# Altium schematic sheet mcu.SchDoc
size A3
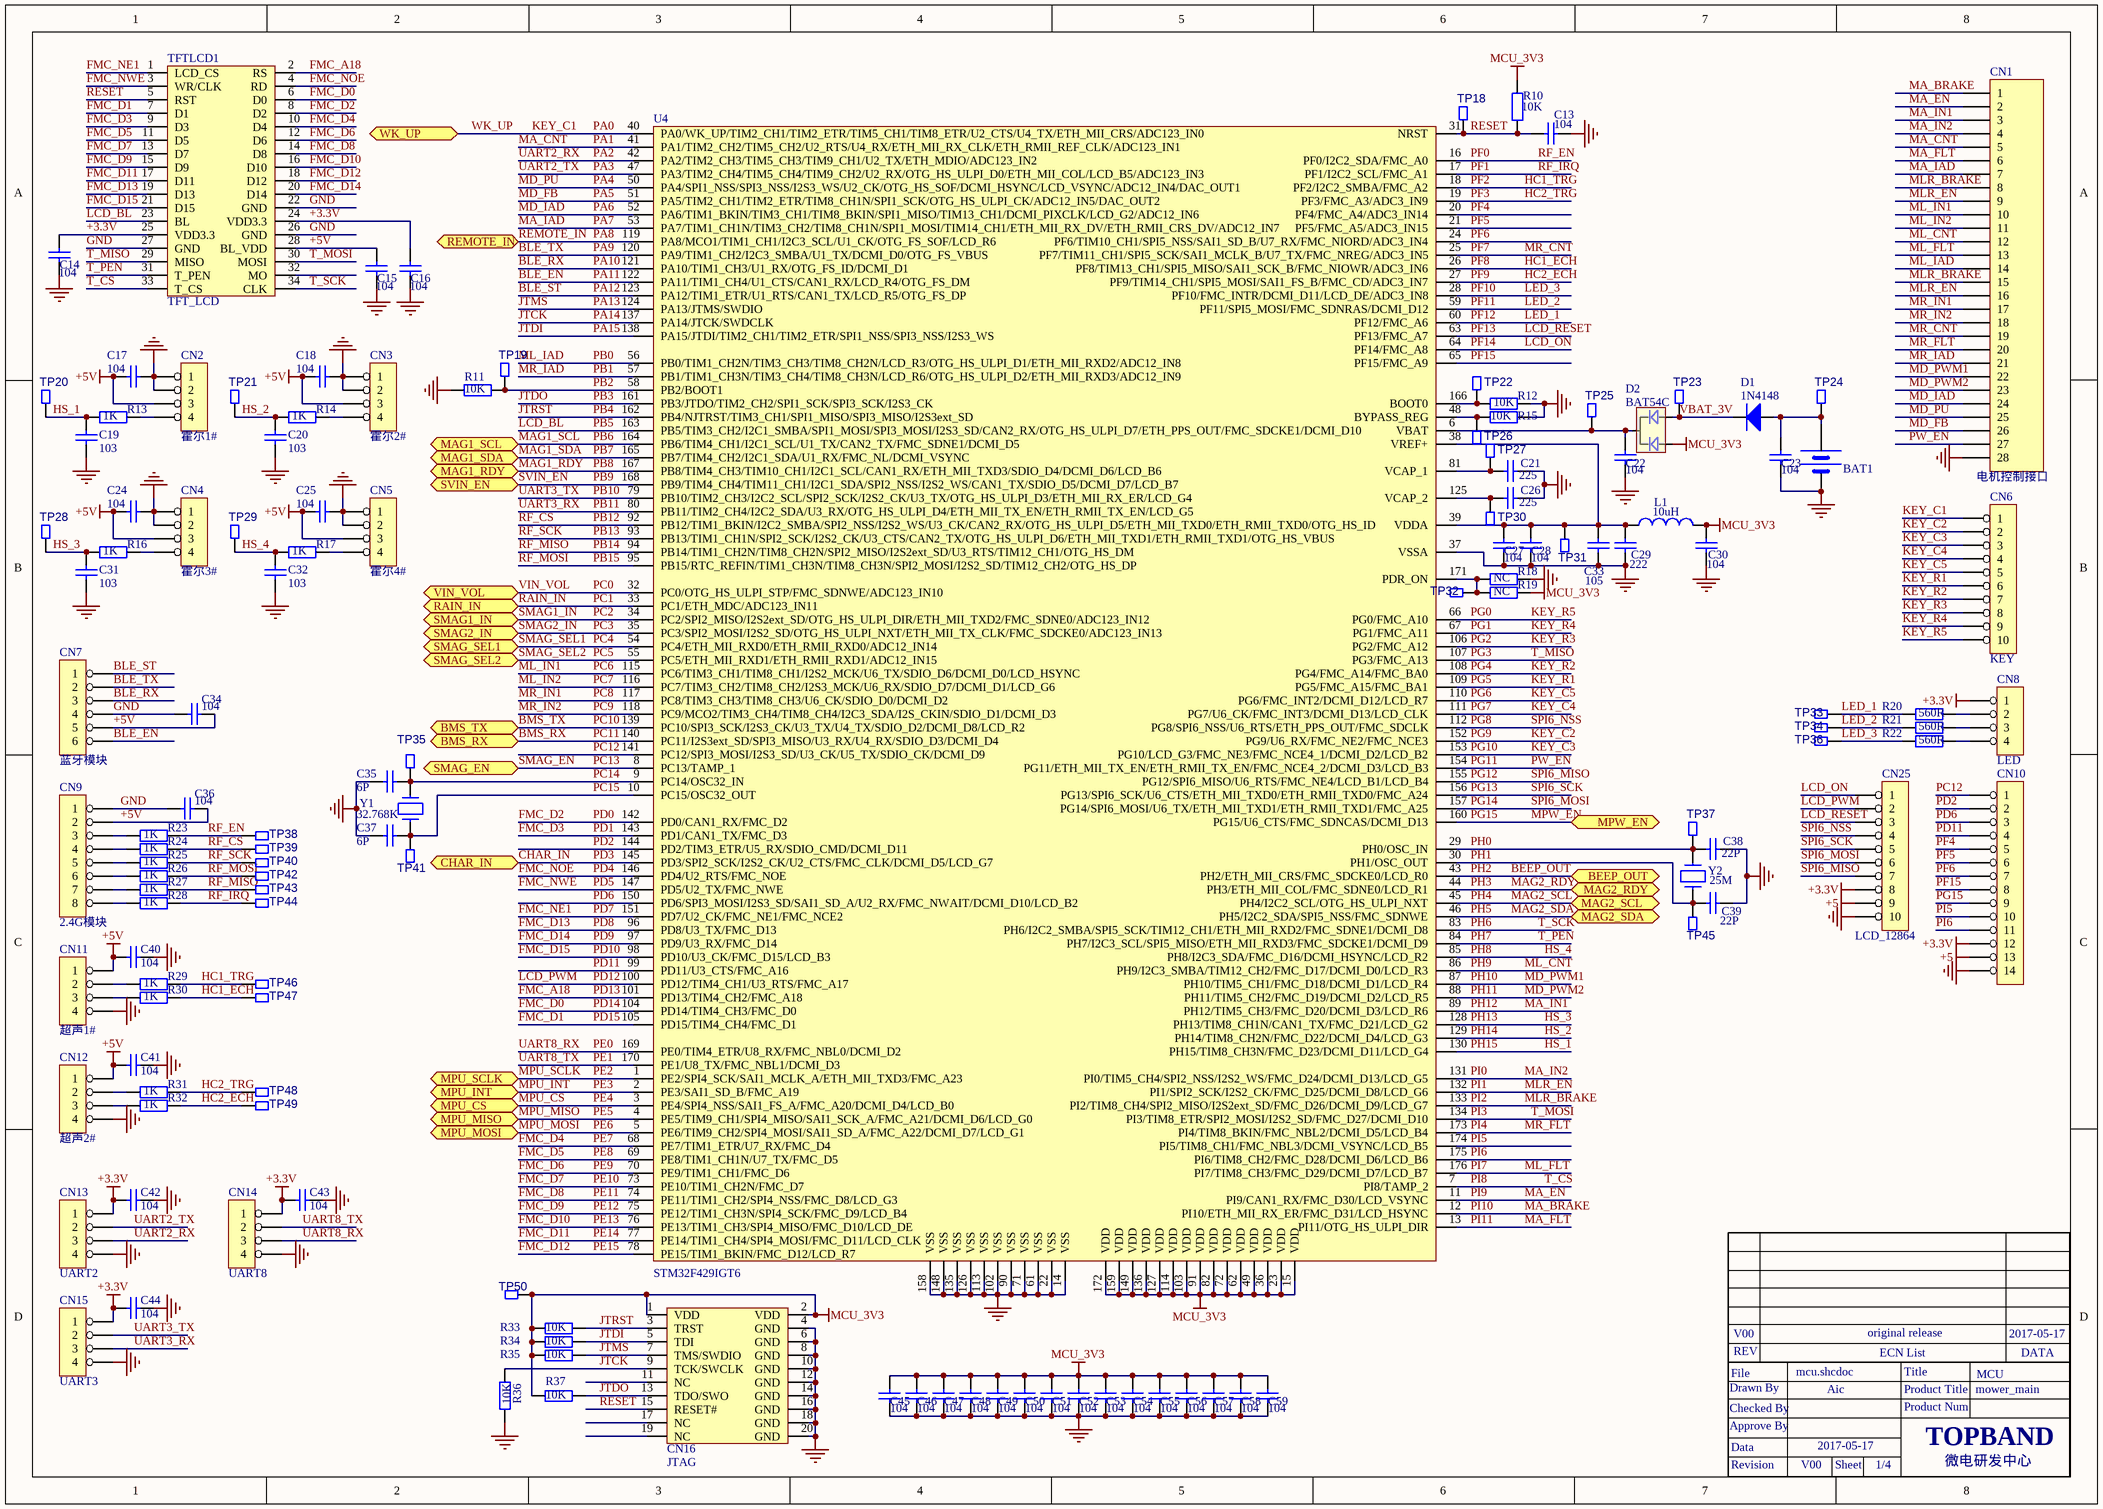
[diagram p0: mcu.SchDoc]

## Parts
BAT1  BATT  [BATM]  (value not drawn)
C13  104  [0603C]
C14  104  [0603C]
C15  104  [0603C]
C16  104  [0603C]
C17  104  [0603C]
C18  104  [0603C]
C19  103  [0603C]
C20  103  [0603C]
C21  225  [0603C]
C22  104  [0603C]
C23  104  [0603C]
C24  104  [0603C]
C25  104  [0603C]
C26  225  [0603C]
C27  104  [0603C]
C28  104  [0603C]
C29  222  [0603C]
C30  104  [0603C]
C31  103  [0603C]
C32  103  [0603C]
C33  105  [0603C]
C34  104  [0603C]
C35  6P  [0603C]
C36  104  [0603C]
C37  6P  [0603C]
C38  22P  [0603C]
C39  22P  [0603C]
C40  104  [0603C]
C41  104  [0603C]
C42  104  [0603C]
C43  104  [0603C]
C44  104  [0603C]
C45  104  [0603C]
C46  104  [0603C]
C47  104  [0603C]
C48  104  [0603C]
C49  104  [0603C]
C50  104  [0603C]
C51  104  [0603C]
C52  104  [0603C]
C53  104  [0603C]
C54  104  [0603C]
C55  104  [0603C]
C56  104  [0603C]
C57  104  [0603C]
C58  104  [0603C]
C59  104  [0603C]
CN1  电机控制接口  [CON2.54-2*14]
CN2  霍尔1#  [CON4-2.54]
CN3  霍尔2#  [CON4-2.54]
CN4  霍尔3#  [CON4-2.54]
CN5  霍尔4#  [CON4-2.54]
CN6  KEY  [CON2.54_10]
CN7  蓝牙模块  [CON6-2.54]
CN8  LED  [CON4-2.54]
CN9  2.4G模块  [CON2*4-2.54]
CN10  (no value)  [CON14-2.0卧式]
CN11  超声1#  [CON4-2.54]
CN12  超声2#  [CON4-2.54]
CN13  UART2  [CON4-2.54]
CN14  UART8  [CON4-2.54]
CN15  UART3  [CON4-2.54]
CN16  JTAG  [JTAG_20]
CN25  LCD_12864  [CON2.54_10]
D1  1N4148  [SOD-123]
D2  BAT54C  [SOT-23]
L1  10uH  [0805L-BOT]
R10  10K  [0603R]
R11  10K  [0603R]
R12  10K  [0603R]
R13  1K  [0603R]
R14  1K  [0603R]
R15  10K  [0603R]
R16  1K  [0603R]
R17  1K  [0603R]
R18  NC  [0603R]
R19  NC  [0603R]
R20  560R  [0603R]
R21  560R  [0603R]
R22  560R  [0603R]
R23  1K  [0603R]
R24  1K  [0603R]
R25  1K  [0603R]
R26  1K  [0603R]
R27  1K  [0603R]
R28  1K  [0603R]
R29  1K  [0603R]
R30  1K  [0603R]
R31  1K  [0603R]
R32  1K  [0603R]
R33  10K  [0603R]
R34  10K  [0603R]
R35  10K  [0603R]
R36  10K  [0603R]
R37  10K  [0603R]
TFTLCD1  TFT_LCD  [db2*17-4.3]
TP18  TP  [TEST-0.8MM]  (value not drawn)
TP19  TP  [TEST-0.8MM]  (value not drawn)
TP20  TP  [TEST-0.8MM]  (value not drawn)
TP21  TP  [TEST-0.8MM]  (value not drawn)
TP22  TP  [TEST-0.8MM]  (value not drawn)
TP23  TP  [TEST-0.8MM]  (value not drawn)
TP24  TP  [TEST-0.8MM]  (value not drawn)
TP25  TP  [TEST-0.8MM]  (value not drawn)
TP26  TP  [TEST-0.8MM]  (value not drawn)
TP27  TP  [TEST-0.8MM]  (value not drawn)
TP28  TP  [TEST-0.8MM]  (value not drawn)
TP29  TP  [TEST-0.8MM]  (value not drawn)
TP30  TP  [TEST-0.8MM]  (value not drawn)
TP31  TP  [TEST-0.8MM]  (value not drawn)
TP32  TP  [TEST-0.8MM]  (value not drawn)
TP33  TP  [TEST-0.8MM]  (value not drawn)
TP34  TP  [TEST-0.8MM]  (value not drawn)
TP35  TP  [TEST-0.8MM]  (value not drawn)
TP36  TP  [TEST-0.8MM]  (value not drawn)
TP37  TP  [TEST-0.8MM]  (value not drawn)
TP38  TP  [TEST-0.8MM]  (value not drawn)
TP39  TP  [TEST-0.8MM]  (value not drawn)
TP40  TP  [TEST-0.8MM]  (value not drawn)
TP41  TP  [TEST-0.8MM]  (value not drawn)
TP42  TP  [TEST-0.8MM]  (value not drawn)
TP43  TP  [TEST-0.8MM]  (value not drawn)
TP44  TP  [TEST-0.8MM]  (value not drawn)
TP45  TP  [TEST-0.8MM]  (value not drawn)
TP46  TP  [TEST-0.8MM]  (value not drawn)
TP47  TP  [TEST-0.8MM]  (value not drawn)
TP48  TP  [TEST-0.8MM]  (value not drawn)
TP49  TP  [TEST-0.8MM]  (value not drawn)
TP50  TP  [TEST-0.8MM]  (value not drawn)
U4  STM32F429IGT6  [LQFP176]
Y1  32.768K  [XTAL1]
Y2  25M  [XTAL-J]

## Ports
BEEP_OUT, BMS_RX, BMS_TX, CHAR_IN, MAG1_RDY, MAG1_SCL, MAG1_SDA, MAG2_RDY, MAG2_SCL, MAG2_SDA, MPU_CS, MPU_INT, MPU_MISO, MPU_MOSI, MPU_SCLK, MPW_EN, RAIN_IN, REMOTE_IN, SMAG1_IN, SMAG2_IN, SMAG_EN, SMAG_SEL1, SMAG_SEL2, SVIN_EN, VIN_VOL, WK_UP

## Nets
+3.3V: C14.2 C16.2 C42.1 C43.1 C44.1 CN8.1 CN10.12 CN13.1 CN14.1 CN15.1 CN25.8 TFTLCD1.24(VDD3.3) TFTLCD1.25(VDD3.3)
+5: CN10.13 CN25.9
+5V: C15.2 C17.1 C18.1 C24.1 C25.1 C34.1 C36.2 C40.1 C41.1 CN2.3 CN3.3 CN4.3 CN5.3 CN7.5 CN9.2 CN11.1 CN12.1 TFTLCD1.28(BL_VDD)
GND: BAT1.2(GND) C13.1 C14.1 C15.1 C16.1 C17.2 C18.2 C19.1 C20.1 C21.1 C22.2 C23.2 C24.2 C25.2 C26.1 C27.2 C28.2 C29.2 C30.2 C31.1 C32.1 C33.2 C34.2 C35.1 C36.1 C37.1 C38.1 C39.1 C40.2 C41.2 C42.2 C43.2 C44.2 C45.2 C46.2 C47.2 C48.2 C49.2 C50.2 C51.2 C52.2 C53.2 C54.2 C55.2 C56.2 C57.2 C58.2 C59.2 CN1.28 CN2.1 CN2.2 CN3.1 CN3.2 CN4.1 CN4.2 CN5.1 CN5.2 CN7.4 CN9.1 CN10.14 CN11.4 CN12.4 CN13.4 CN14.4 CN15.4 CN16.4(GND) CN16.6(GND) CN16.8(GND) CN16.10(GND) CN16.12(GND) CN16.14(GND) CN16.16(GND) CN16.18(GND) CN16.20(GND) CN25.10 R11.1 R12.1 R15.1 R18.1 R36.2 TFTLCD1.22(GND) TFTLCD1.26(GND) TFTLCD1.27(GND) U4.14(VSS) U4.22(VSS) U4.37(VSSA) U4.61(VSS) U4.71(VSS) U4.90(VSS) U4.102(VSS) U4.113(VSS) U4.126(VSS) U4.135(VSS) U4.148(VSS) U4.158(VSS)
MCU_3V3: C30.1 C45.1 C46.1 C47.1 C48.1 C49.1 C50.1 C51.1 C52.1 C53.1 C54.1 C55.1 C56.1 C57.1 C58.1 C59.1 CN16.1(VDD) CN16.2(VDD) D2.1 L1.2 R10.2 R19.1 R33.2 R34.2 R35.2 R37.2 TP50.1 U4.15(VDD) U4.23(VDD) U4.36(VDD) U4.49(VDD) U4.62(VDD) U4.72(VDD) U4.82(VDD) U4.91(VDD) U4.103(VDD) U4.114(VDD) U4.127(VDD) U4.136(VDD) U4.149(VDD) U4.159(VDD) U4.172(VDD)
BEEP_OUT: U4.43(PH2/ETH_MII_CRS/FMC_SDCKE0/LCD_R0) ; port BEEP_OUT  [also labelled PH2]
BLE_EN: CN7.6 U4.122(PA11/TIM1_CH4/U1_CTS/CAN1_RX/LCD_R4/OTG_FS_DM)  [also labelled PA11]
BLE_RX: CN7.3 U4.121(PA10/TIM1_CH3/U1_RX/OTG_FS_ID/DCMI_D1)  [also labelled PA10]
BLE_ST: CN7.1 U4.123(PA12/TIM1_ETR/U1_RTS/CAN1_TX/LCD_R5/OTG_FS_DP)  [also labelled PA12]
BLE_TX: CN7.2 U4.120(PA9/TIM1_CH2/I2C3_SMBA/U1_TX/DCMI_D0/OTG_FS_VBUS)  [also labelled PA9]
BMS_RX: U4.140(PC11/I2S3ext_SD/SPI3_MISO/U3_RX/U4_RX/SDIO_D3/DCMI_D4) ; port BMS_RX  [also labelled PC11]
BMS_TX: U4.139(PC10/SPI3_SCK/I2S3_CK/U3_TX/U4_TX/SDIO_D2/DCMI_D8/LCD_R2) ; port BMS_TX  [also labelled PC10]
CHAR_IN: U4.145(PD3/SPI2_SCK/I2S2_CK/U2_CTS/FMC_CLK/DCMI_D5/LCD_G7) ; port CHAR_IN  [also labelled PD3]
FMC_A18: TFTLCD1.2(RS) U4.101(PD13/TIM4_CH2/FMC_A18)  [also labelled PD13]
FMC_D0: TFTLCD1.6(D0) U4.104(PD14/TIM4_CH3/FMC_D0)  [also labelled PD14]
FMC_D1: TFTLCD1.7(D1) U4.105(PD15/TIM4_CH4/FMC_D1)  [also labelled PD15]
FMC_D2: TFTLCD1.8(D2) U4.142(PD0/CAN1_RX/FMC_D2)  [also labelled PD0]
FMC_D3: TFTLCD1.9(D3) U4.143(PD1/CAN1_TX/FMC_D3)  [also labelled PD1]
FMC_D4: TFTLCD1.10(D4) U4.68(PE7/TIM1_ETR/U7_RX/FMC_D4)  [also labelled PE7]
FMC_D5: TFTLCD1.11(D5) U4.69(PE8/TIM1_CH1N/U7_TX/FMC_D5)  [also labelled PE8]
FMC_D6: TFTLCD1.12(D6) U4.70(PE9/TIM1_CH1/FMC_D6)  [also labelled PE9]
FMC_D7: TFTLCD1.13(D7) U4.73(PE10/TIM1_CH2N/FMC_D7)  [also labelled PE10]
FMC_D8: TFTLCD1.14(D8) U4.74(PE11/TIM1_CH2/SPI4_NSS/FMC_D8/LCD_G3)  [also labelled PE11]
FMC_D9: TFTLCD1.15(D9) U4.75(PE12/TIM1_CH3N/SPI4_SCK/FMC_D9/LCD_B4)  [also labelled PE12]
FMC_D10: TFTLCD1.16(D10) U4.76(PE13/TIM1_CH3/SPI4_MISO/FMC_D10/LCD_DE)  [also labelled PE13]
FMC_D11: TFTLCD1.17(D11) U4.77(PE14/TIM1_CH4/SPI4_MOSI/FMC_D11/LCD_CLK)  [also labelled PE14]
FMC_D12: TFTLCD1.18(D12) U4.78(PE15/TIM1_BKIN/FMC_D12/LCD_R7)  [also labelled PE15]
FMC_D13: TFTLCD1.19(D13) U4.96(PD8/U3_TX/FMC_D13)  [also labelled PD8]
FMC_D14: TFTLCD1.20(D14) U4.97(PD9/U3_RX/FMC_D14)  [also labelled PD9]
FMC_D15: TFTLCD1.21(D15) U4.98(PD10/U3_CK/FMC_D15/LCD_B3)  [also labelled PD10]
FMC_NE1: TFTLCD1.1(LCD_CS) U4.151(PD7/U2_CK/FMC_NE1/FMC_NCE2)  [also labelled PD7]
FMC_NOE: TFTLCD1.4(RD) U4.146(PD4/U2_RTS/FMC_NOE)  [also labelled PD4]
FMC_NWE: TFTLCD1.3(WR/CLK) U4.147(PD5/U2_TX/FMC_NWE)  [also labelled PD5]
HC1_ECH: R30.1 TP47.1 U4.26(PF8/TIM13_CH1/SPI5_MISO/SAI1_SCK_B/FMC_NIOWR/ADC3_IN6)  [also labelled PF8]
HC1_TRG: R29.1 TP46.1 U4.18(PF2/I2C2_SMBA/FMC_A2)  [also labelled PF2]
HC2_ECH: R32.1 TP49.1 U4.27(PF9/TIM14_CH1/SPI5_MOSI/SAI1_FS_B/FMC_CD/ADC3_IN7)  [also labelled PF9]
HC2_TRG: R31.1 TP48.1 U4.19(PF3/FMC_A3/ADC3_IN9)  [also labelled PF3]
HS_1: C19.2 R13.2 TP20.1 U4.130(PH15/TIM8_CH3N/FMC_D23/DCMI_D11/LCD_G4)  [also labelled PH15]
HS_2: C20.2 R14.2 TP21.1 U4.129(PH14/TIM8_CH2N/FMC_D22/DCMI_D4/LCD_G3)  [also labelled PH14]
HS_3: C31.2 R16.2 TP28.1 U4.128(PH13/TIM8_CH1N/CAN1_TX/FMC_D21/LCD_G2)  [also labelled PH13]
HS_4: C32.2 R17.2 TP29.1 U4.85(PH8/I2C3_SDA/FMC_D16/DCMI_HSYNC/LCD_R2)  [also labelled PH8]
JTCK: CN16.9(TCK/SWCLK) R36.1 U4.137(PA14/JTCK/SWDCLK)  [also labelled PA14]
JTDI: CN16.5(TDI) R34.1 U4.138(PA15/JTDI/TIM2_CH1/TIM2_ETR/SPI1_NSS/SPI3_NSS/I2S3_WS)  [also labelled PA15]
JTDO: CN16.13(TDO/SWO) R37.1 U4.161(PB3/JTDO/TIM2_CH2/SPI1_SCK/SPI3_SCK/I2S3_CK)  [also labelled PB3]
JTMS: CN16.7(TMS/SWDIO) R35.1 U4.124(PA13/JTMS/SWDIO)  [also labelled PA13]
JTRST: CN16.3(TRST) R33.1 U4.162(PB4/NJTRST/TIM3_CH1/SPI1_MISO/SPI3_MISO/I2S3ext_SD)  [also labelled PB4]
KEY_C1: CN6.1 U4.40(PA0/WK_UP/TIM2_CH1/TIM2_ETR/TIM5_CH1/TIM8_ETR/U2_CTS/U4_TX/ETH_MII_CRS/ADC123_IN0) ; port WK_UP  [also labelled PA0, WK_UP]
KEY_C2: CN6.2 U4.152(PG9/U6_RX/FMC_NE2/FMC_NCE3)  [also labelled PG9]
KEY_C3: CN6.3 U4.153(PG10/LCD_G3/FMC_NE3/FMC_NCE4_1/DCMI_D2/LCD_B2)  [also labelled PG10]
KEY_C4: CN6.4 U4.111(PG7/U6_CK/FMC_INT3/DCMI_D13/LCD_CLK)  [also labelled PG7]
KEY_C5: CN6.5 U4.110(PG6/FMC_INT2/DCMI_D12/LCD_R7)  [also labelled PG6]
KEY_R1: CN6.6 U4.109(PG5/FMC_A15/FMC_BA1)  [also labelled PG5]
KEY_R2: CN6.7 U4.108(PG4/FMC_A14/FMC_BA0)  [also labelled PG4]
KEY_R3: CN6.8 U4.106(PG2/FMC_A12)  [also labelled PG2]
KEY_R4: CN6.9 U4.67(PG1/FMC_A11)  [also labelled PG1]
KEY_R5: CN6.10 U4.66(PG0/FMC_A10)  [also labelled PG0]
LCD_BL: TFTLCD1.23(BL) U4.163(PB5/TIM3_CH2/I2C1_SMBA/SPI1_MOSI/SPI3_MOSI/I2S3_SD/CAN2_RX/OTG_HS_ULPI_D7/ETH_PPS_OUT/FMC_SDCKE1/DCMI_D10)  [also labelled PB5]
LCD_ON: CN25.1 U4.64(PF14/FMC_A8)  [also labelled PF14]
LCD_PWM: CN25.2 U4.100(PD12/TIM4_CH1/U3_RTS/FMC_A17)  [also labelled PD12]
LCD_RESET: CN25.3 U4.63(PF13/FMC_A7)  [also labelled PF13]
LED_1: R20.2 TP33.1 U4.60(PF12/FMC_A6)  [also labelled PF12]
LED_2: R21.2 TP34.1 U4.59(PF11/SPI5_MOSI/FMC_SDNRAS/DCMI_D12)  [also labelled PF11]
LED_3: R22.2 TP36.1 U4.28(PF10/FMC_INTR/DCMI_D11/LCD_DE/ADC3_IN8)  [also labelled PF10]
MA_BRAKE: CN1.1 U4.12(PI10/ETH_MII_RX_ER/FMC_D31/LCD_HSYNC)  [also labelled PI10]
MA_CNT: CN1.5 U4.41(PA1/TIM2_CH2/TIM5_CH2/U2_RTS/U4_RX/ETH_MII_RX_CLK/ETH_RMII_REF_CLK/ADC123_IN1)  [also labelled PA1]
MA_EN: CN1.2 U4.11(PI9/CAN1_RX/FMC_D30/LCD_VSYNC)  [also labelled PI9]
MA_FLT: CN1.6 U4.13(PI11/OTG_HS_ULPI_DIR)  [also labelled PI11]
MA_IAD: CN1.7 U4.53(PA7/TIM1_CH1N/TIM3_CH2/TIM8_CH1N/SPI1_MOSI/TIM14_CH1/ETH_MII_RX_DV/ETH_RMII_CRS_DV/ADC12_IN7)  [also labelled PA7]
MA_IN1: CN1.3 U4.89(PH12/TIM5_CH3/FMC_D20/DCMI_D3/LCD_R6)  [also labelled PH12]
MA_IN2: CN1.4 U4.131(PI0/TIM5_CH4/SPI2_NSS/I2S2_WS/FMC_D24/DCMI_D13/LCD_G5)  [also labelled PI0]
MAG1_RDY: U4.167(PB8/TIM4_CH3/TIM10_CH1/I2C1_SCL/CAN1_RX/ETH_MII_TXD3/SDIO_D4/DCMI_D6/LCD_B6) ; port MAG1_RDY  [also labelled PB8]
MAG1_SCL: U4.164(PB6/TIM4_CH1/I2C1_SCL/U1_TX/CAN2_TX/FMC_SDNE1/DCMI_D5) ; port MAG1_SCL  [also labelled PB6]
MAG1_SDA: U4.165(PB7/TIM4_CH2/I2C1_SDA/U1_RX/FMC_NL/DCMI_VSYNC) ; port MAG1_SDA  [also labelled PB7]
MAG2_RDY: U4.44(PH3/ETH_MII_COL/FMC_SDNE0/LCD_R1) ; port MAG2_RDY  [also labelled PH3]
MAG2_SCL: U4.45(PH4/I2C2_SCL/OTG_HS_ULPI_NXT) ; port MAG2_SCL  [also labelled PH4]
MAG2_SDA: U4.46(PH5/I2C2_SDA/SPI5_NSS/FMC_SDNWE) ; port MAG2_SDA  [also labelled PH5]
MD_FB: CN1.26 U4.51(PA5/TIM2_CH1/TIM2_ETR/TIM8_CH1N/SPI1_SCK/OTG_HS_ULPI_CK/ADC12_IN5/DAC_OUT2)  [also labelled PA5]
MD_IAD: CN1.24 U4.52(PA6/TIM1_BKIN/TIM3_CH1/TIM8_BKIN/SPI1_MISO/TIM13_CH1/DCMI_PIXCLK/LCD_G2/ADC12_IN6)  [also labelled PA6]
MD_PU: CN1.25 U4.50(PA4/SPI1_NSS/SPI3_NSS/I2S3_WS/U2_CK/OTG_HS_SOF/DCMI_HSYNC/LCD_VSYNC/ADC12_IN4/DAC_OUT1)  [also labelled PA4]
MD_PWM1: CN1.22 U4.87(PH10/TIM5_CH1/FMC_D18/DCMI_D1/LCD_R4)  [also labelled PH10]
MD_PWM2: CN1.23 U4.88(PH11/TIM5_CH2/FMC_D19/DCMI_D2/LCD_R5)  [also labelled PH11]
ML_CNT: CN1.12 U4.86(PH9/I2C3_SMBA/TIM12_CH2/FMC_D17/DCMI_D0/LCD_R3)  [also labelled PH9]
ML_FLT: CN1.13 U4.176(PI7/TIM8_CH3/FMC_D29/DCMI_D7/LCD_B7)  [also labelled PI7]
ML_IAD: CN1.14 U4.56(PB0/TIM1_CH2N/TIM3_CH3/TIM8_CH2N/LCD_R3/OTG_HS_ULPI_D1/ETH_MII_RXD2/ADC12_IN8)  [also labelled PB0]
ML_IN1: CN1.10 U4.115(PC6/TIM3_CH1/TIM8_CH1/I2S2_MCK/U6_TX/SDIO_D6/DCMI_D0/LCD_HSYNC)  [also labelled PC6]
ML_IN2: CN1.11 U4.116(PC7/TIM3_CH2/TIM8_CH2/I2S3_MCK/U6_RX/SDIO_D7/DCMI_D1/LCD_G6)  [also labelled PC7]
MLR_BRAKE: CN1.8 CN1.15 U4.133(PI2/TIM8_CH4/SPI2_MISO/I2S2ext_SD/FMC_D26/DCMI_D9/LCD_G7)  [also labelled PI2]
MLR_EN: CN1.9 CN1.16 U4.132(PI1/SPI2_SCK/I2S2_CK/FMC_D25/DCMI_D8/LCD_G6)  [also labelled PI1]
MPU_CS: U4.3(PE4/SPI4_NSS/SAI1_FS_A/FMC_A20/DCMI_D4/LCD_B0) ; port MPU_CS  [also labelled PE4]
MPU_INT: U4.2(PE3/SAI1_SD_B/FMC_A19) ; port MPU_INT  [also labelled PE3]
MPU_MISO: U4.4(PE5/TIM9_CH1/SPI4_MISO/SAI1_SCK_A/FMC_A21/DCMI_D6/LCD_G0) ; port MPU_MISO  [also labelled PE5]
MPU_MOSI: U4.5(PE6/TIM9_CH2/SPI4_MOSI/SAI1_SD_A/FMC_A22/DCMI_D7/LCD_G1) ; port MPU_MOSI  [also labelled PE6]
MPU_SCLK: U4.1(PE2/SPI4_SCK/SAI1_MCLK_A/ETH_MII_TXD3/FMC_A23) ; port MPU_SCLK  [also labelled PE2]
MPW_EN: CN10.9 U4.160(PG15/U6_CTS/FMC_SDNCAS/DCMI_D13) ; port MPW_EN  [also labelled PG15]
MR_CNT: CN1.19 U4.25(PF7/TIM11_CH1/SPI5_SCK/SAI1_MCLK_B/U7_TX/FMC_NREG/ADC3_IN5)  [also labelled PF7]
MR_FLT: CN1.20 U4.173(PI4/TIM8_BKIN/FMC_NBL2/DCMI_D5/LCD_B4)  [also labelled PI4]
MR_IAD: CN1.21 U4.57(PB1/TIM1_CH3N/TIM3_CH4/TIM8_CH3N/LCD_R6/OTG_HS_ULPI_D2/ETH_MII_RXD3/ADC12_IN9)  [also labelled PB1]
MR_IN1: CN1.17 U4.117(PC8/TIM3_CH3/TIM8_CH3/U6_CK/SDIO_D0/DCMI_D2)  [also labelled PC8]
MR_IN2: CN1.18 U4.118(PC9/MCO2/TIM3_CH4/TIM8_CH4/I2C3_SDA/I2S_CKIN/SDIO_D1/DCMI_D3)  [also labelled PC9]
PA2: CN13.3 U4.42(PA2/TIM2_CH3/TIM5_CH3/TIM9_CH1/U2_TX/ETH_MDIO/ADC123_IN2)  [also labelled UART2_RX]
PA3: CN13.2 U4.47(PA3/TIM2_CH4/TIM5_CH4/TIM9_CH2/U2_RX/OTG_HS_ULPI_D0/ETH_MII_COL/LCD_B5/ADC123_IN3)  [also labelled UART2_TX]
PA8: U4.119(PA8/MCO1/TIM1_CH1/I2C3_SCL/U1_CK/OTG_FS_SOF/LCD_R6) ; port REMOTE_IN  [also labelled REMOTE_IN]
PB2: R11.2 TP19.1 U4.58(PB2/BOOT1)
PB9: U4.168(PB9/TIM4_CH4/TIM11_CH1/I2C1_SDA/SPI2_NSS/I2S2_WS/CAN1_TX/SDIO_D5/DCMI_D7/LCD_B7) ; port SVIN_EN  [also labelled SVIN_EN]
PB10: CN15.2 U4.79(PB10/TIM2_CH3/I2C2_SCL/SPI2_SCK/I2S2_CK/U3_TX/OTG_HS_ULPI_D3/ETH_MII_RX_ER/LCD_G4)  [also labelled UART3_TX]
PB11: CN15.3 U4.80(PB11/TIM2_CH4/I2C2_SDA/U3_RX/OTG_HS_ULPI_D4/ETH_MII_TX_EN/ETH_RMII_TX_EN/LCD_G5)  [also labelled UART3_RX]
PB12: R24.1 TP39.1 U4.92(PB12/TIM1_BKIN/I2C2_SMBA/SPI2_NSS/I2S2_WS/U3_CK/CAN2_RX/OTG_HS_ULPI_D5/ETH_MII_TXD0/ETH_RMII_TXD0/OTG_HS_ID)  [also labelled RF_CS]
PB13: R25.1 TP40.1 U4.93(PB13/TIM1_CH1N/SPI2_SCK/I2S2_CK/U3_CTS/CAN2_TX/OTG_HS_ULPI_D6/ETH_MII_TXD1/ETH_RMII_TXD1/OTG_HS_VBUS)  [also labelled RF_SCK]
PB14: R27.1 TP43.1 U4.94(PB14/TIM1_CH2N/TIM8_CH2N/SPI2_MISO/I2S2ext_SD/U3_RTS/TIM12_CH1/OTG_HS_DM)  [also labelled RF_MISO]
PB15: R26.1 TP42.1 U4.95(PB15/RTC_REFIN/TIM1_CH3N/TIM8_CH3N/SPI2_MOSI/I2S2_SD/TIM12_CH2/OTG_HS_DP)  [also labelled RF_MOSI]
PC0: U4.32(PC0/OTG_HS_ULPI_STP/FMC_SDNWE/ADC123_IN10) ; port VIN_VOL  [also labelled VIN_VOL]
PC1: U4.33(PC1/ETH_MDC/ADC123_IN11) ; port RAIN_IN  [also labelled RAIN_IN]
PC2: U4.34(PC2/SPI2_MISO/I2S2ext_SD/OTG_HS_ULPI_DIR/ETH_MII_TXD2/FMC_SDNE0/ADC123_IN12) ; port SMAG1_IN  [also labelled SMAG1_IN]
PC3: U4.35(PC3/SPI2_MOSI/I2S2_SD/OTG_HS_ULPI_NXT/ETH_MII_TX_CLK/FMC_SDCKE0/ADC123_IN13) ; port SMAG2_IN  [also labelled SMAG2_IN]
PC4: U4.54(PC4/ETH_MII_RXD0/ETH_RMII_RXD0/ADC12_IN14) ; port SMAG_SEL1  [also labelled SMAG_SEL1]
PC5: U4.55(PC5/ETH_MII_RXD1/ETH_RMII_RXD1/ADC12_IN15) ; port SMAG_SEL2  [also labelled SMAG_SEL2]
PC12: CN10.1 U4.141(PC12/SPI3_MOSI/I2S3_SD/U3_CK/U5_TX/SDIO_CK/DCMI_D9)
PC13: U4.8(PC13/TAMP_1) ; port SMAG_EN  [also labelled SMAG_EN]
PC14: C35.2 TP35.1 U4.9(PC14/OSC32_IN) Y1.2
PC15: C37.2 TP41.1 U4.10(PC15/OSC32_OUT) Y1.1
PD2: CN10.2 U4.144(PD2/TIM3_ETR/U5_RX/SDIO_CMD/DCMI_D11)
PD6: CN10.3 U4.150(PD6/SPI3_MOSI/I2S3_SD/SAI1_SD_A/U2_RX/FMC_NWAIT/DCMI_D10/LCD_B2)
PD11: CN10.4 U4.99(PD11/U3_CTS/FMC_A16)
PE0: CN14.3 U4.169(PE0/TIM4_ETR/U8_RX/FMC_NBL0/DCMI_D2)  [also labelled UART8_RX]
PE1: CN14.2 U4.170(PE1/U8_TX/FMC_NBL1/DCMI_D3)  [also labelled UART8_TX]
PF0: R23.1 TP38.1 U4.16(PF0/I2C2_SDA/FMC_A0)  [also labelled RF_EN]
PF1: R28.1 TP44.1 U4.17(PF1/I2C2_SCL/FMC_A1)  [also labelled RF_IRQ]
PF4: CN10.5 U4.20(PF4/FMC_A4/ADC3_IN14)
PF5: CN10.6 U4.21(PF5/FMC_A5/ADC3_IN15)
PF6: CN10.7 U4.24(PF6/TIM10_CH1/SPI5_NSS/SAI1_SD_B/U7_RX/FMC_NIORD/ADC3_IN4)
PF15: CN10.8 U4.65(PF15/FMC_A9)
PG3: TFTLCD1.29(MISO) U4.107(PG3/FMC_A13)  [also labelled T_MISO]
PG8: CN25.4 U4.112(PG8/SPI6_NSS/U6_RTS/ETH_PPS_OUT/FMC_SDCLK)  [also labelled SPI6_NSS]
PG11: CN1.27 U4.154(PG11/ETH_MII_TX_EN/ETH_RMII_TX_EN/FMC_NCE4_2/DCMI_D3/LCD_B3)  [also labelled PW_EN]
PG12: CN25.7 U4.155(PG12/SPI6_MISO/U6_RTS/FMC_NE4/LCD_B1/LCD_B4)  [also labelled SPI6_MISO]
PG13: CN25.5 U4.156(PG13/SPI6_SCK/U6_CTS/ETH_MII_TXD0/ETH_RMII_TXD0/FMC_A24)  [also labelled SPI6_SCK]
PG14: CN25.6 U4.157(PG14/SPI6_MOSI/U6_TX/ETH_MII_TXD1/ETH_RMII_TXD1/FMC_A25)  [also labelled SPI6_MOSI]
PH0: C38.2 TP37.1 U4.29(PH0/OSC_IN) Y2.2
PH1: C39.2 TP45.1 U4.30(PH1/OSC_OUT) Y2.1
PH6: TFTLCD1.34(CLK) U4.83(PH6/I2C2_SMBA/SPI5_SCK/TIM12_CH1/ETH_MII_RXD2/FMC_SDNE1/DCMI_D8)  [also labelled T_SCK]
PH7: TFTLCD1.31(T_PEN) U4.84(PH7/I2C3_SCL/SPI5_MISO/ETH_MII_RXD3/FMC_SDCKE1/DCMI_D9)  [also labelled T_PEN]
PI3: TFTLCD1.30(MOSI) U4.134(PI3/TIM8_ETR/SPI2_MOSI/I2S2_SD/FMC_D27/DCMI_D10)  [also labelled T_MOSI]
PI5: CN10.10 U4.174(PI5/TIM8_CH1/FMC_NBL3/DCMI_VSYNC/LCD_B5)
PI6: CN10.11 U4.175(PI6/TIM8_CH2/FMC_D28/DCMI_D6/LCD_B6)
PI8: TFTLCD1.33(T_CS) U4.7(PI8/TAMP_2)  [also labelled T_CS]
RESET: C13.2 CN16.15(RESET#) R10.1 TFTLCD1.5(RST) TP18.1 U4.31(NRST)
VBAT_3V: D1.K D2.2 TP23.1
NetBAT1_1: BAT1.1(VCC) C23.1 D1.A TP24.1
NetC21_2: C21.2 TP27.1 U4.81(VCAP_1)
NetC22_1: C22.1 D2.3 TP25.1 U4.6(VBAT)
NetC26_2: C26.2 TP30.1 U4.125(VCAP_2)
NetC27_1: C27.1 C28.1 C29.1 C33.1 L1.1 TP31.1 U4.38(VREF+) U4.39(VDDA)
NetCN2_4: CN2.4 R13.1
NetCN3_4: CN3.4 R14.1
NetCN4_4: CN4.4 R16.1
NetCN5_4: CN5.4 R17.1
NetCN8_2: CN8.2 R20.1
NetCN8_3: CN8.3 R21.1
NetCN8_4: CN8.4 R22.1
NetCN9_3: CN9.3 R23.2
NetCN9_4: CN9.4 R24.2
NetCN9_5: CN9.5 R25.2
NetCN9_6: CN9.6 R26.2
NetCN9_7: CN9.7 R27.2
NetCN9_8: CN9.8 R28.2
NetCN11_2: CN11.2 R29.2
NetCN11_3: CN11.3 R30.2
NetCN12_2: CN12.2 R31.2
NetCN12_3: CN12.3 R32.2
NetR12_2: R12.2 TP22.1 U4.166(BOOT0)
NetR15_2: R15.2 TP26.1 U4.48(BYPASS_REG)
NetR18_2: R18.2 R19.2 TP32.1 U4.171(PDR_ON)

Not connected (* = marked no-connect by the designer): CN16 11(NC) 17(NC) 19(NC); TFTLCD1 32(MO)

## Notes on the sheet
- Drawn By
- File
- REV
- V00
- mcu.shcdoc
- Aic
- original release
- ECN List
- Product Title
- Title
- mower_main
- MCU
- 2017-05-17
- DATA
- Approve By
- Checked By
- Data
- Product Num
- TOPBAND
- Revision
- Sheet
- 1/4
- 微电研发中心

## Library data of the parts
BAT1 = BAT
C13-C59 = Cap(0603): Component Kind: standard; Component Type: standard
CN1 = CON28
CN2-CN5 CN8 CN11-CN15 = 4Pin(2~3.96mm): 插座; U_TABLE: U_SAM01021601; id: 28; Part Number: 4Pin(2~3.96mm); Component Kind: Standard; Component Type: Standard; Designator: 4Pin(2~3.96mm); Footprint: CON4-2.0; Pin Count: 4
CN6 CN25 = 10Pin: 插座; U_TABLE: U_SAM01021601; id: 2; Part Number: 10Pin; Component Kind: Standard; Component Type: Standard; Designator: 10Pin; Footprint: CON10-2.54; Pin Count: 10
CN7 = 6Pin: 插座; U_TABLE: U_SAM01021601; id: 34; Part Number: 6Pin; Component Kind: Standard; Component Type: Standard; Designator: 6Pin; Pin Count: 6
CN9 = 8Pin: 插座; U_TABLE: U_SAM01021601; id: 39; Part Number: 8Pin; Component Kind: Standard; Component Type: Standard; Designator: 8Pin; Footprint: CON8-2.54; Pin Count: 8
CN10 = 14Pin: 插座; U_TABLE: U_SAM01021601; id: 13; Part Number: 14Pin; Component Kind: standard; Component Type: standard; Designator: 14Pin; Footprint: CON14-2.54; Pin Count: 14
D1 = Diode(DO-35)-D: 二极管; U_TABLE: U_SAM010203; id: 32; Part Number: Diode(DO-35)-D; Component Kind: standard; Component Type: standard; Pin Count: 2
D2 = BAT54C: 双肖特基二极管
L1 = Inductor(0805): 电感; U_TABLE: U_SAM010207; id: 140; Part Number: Inductor(0805); Component Kind: standard; Component Type: standard
R10-R12 R15 R18-R22 R33-R37 = Res2: Resistor; Value: 1K; 物料编码: 150103083; Published: 8-Jun-2000; LatestRevisionDate: 17-Jul-2002; LatestRevisionNote: Re-released for DXP Platform.; PackageReference: AXIAL-0.4; Publisher: Altium Limited
R13 R14 R16 R17 R23-R32 = Res2: Resistor; 物料编码: 150103083; Published: 8-Jun-2000; LatestRevisionDate: 17-Jul-2002; LatestRevisionNote: Re-released for DXP Platform.; PackageReference: AXIAL-0.4; Publisher: Altium Limited; Value: 1K
Y1 Y2 = XTAL-J: 晶振; U_TABLE: U_SAM010212; id: 101; Part Number: XTAL-J; Component Kind: standard; Component Type: standard; Pin Count: 2